# Altium project ArduinoUnoSheild.PrjPcb
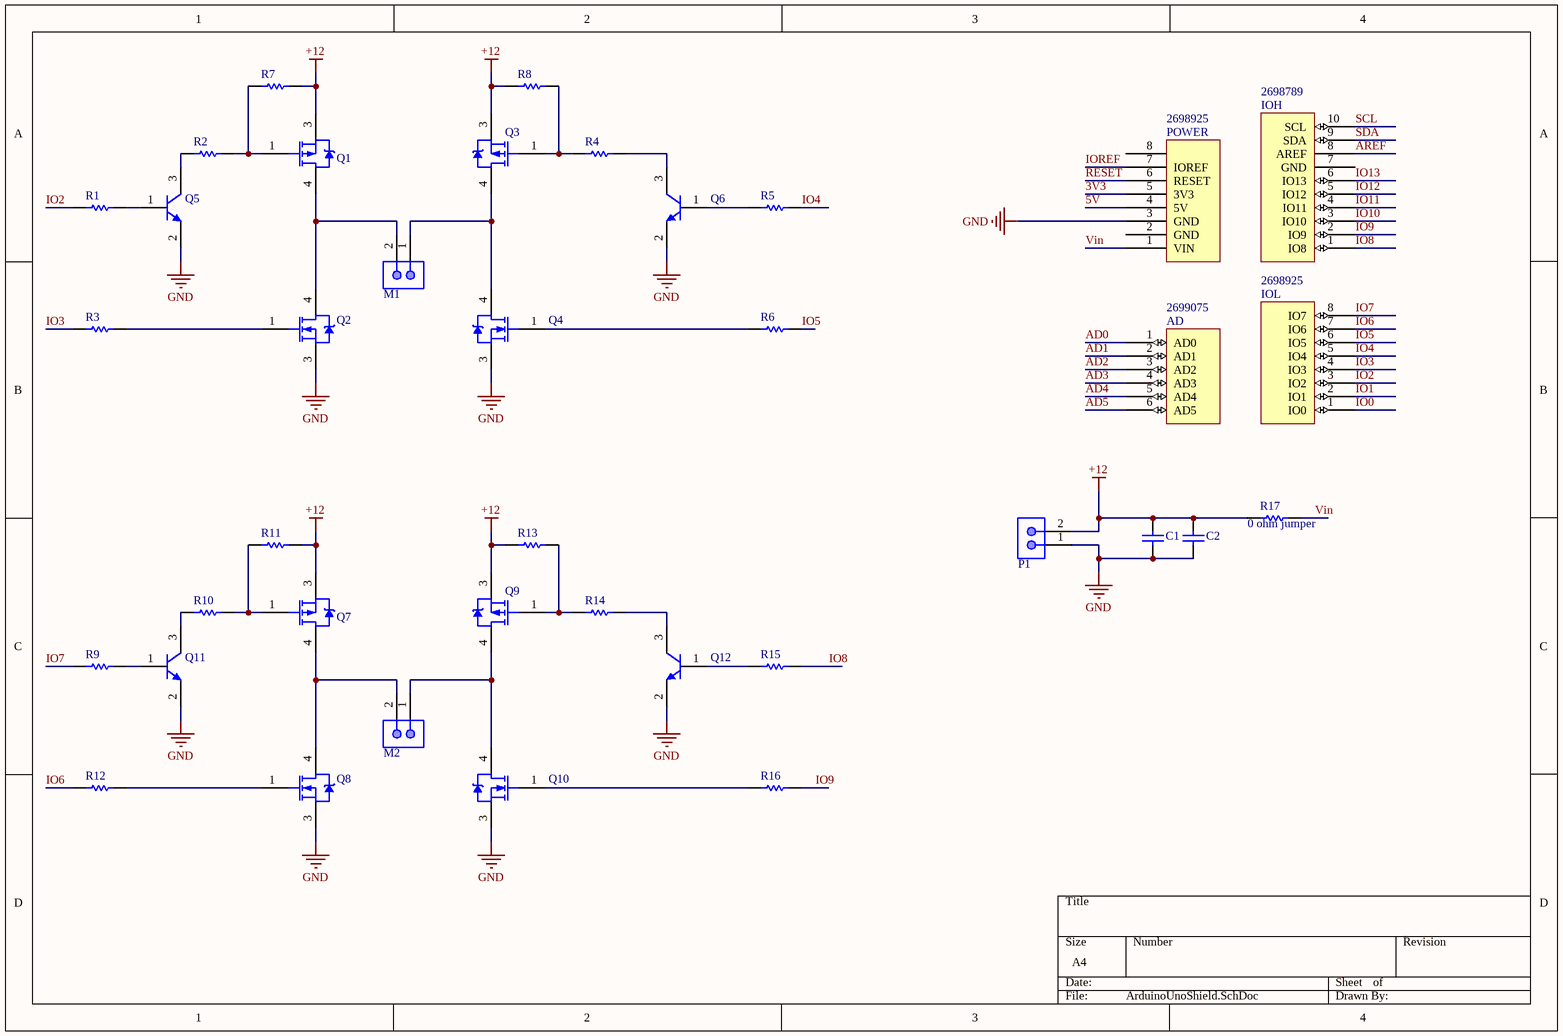
[diagram p0: ArduinoUnoShield.SchDoc]
1 sheet, 38 parts. Net scope: global (net labels, ports and power ports of the same name join across sheets).
Board file: ArduinoUnoShield.PcbDoc

## Sheet ArduinoUnoShield.SchDoc
size A4

### Parts
AD  Supplier Part Number 4: 2699075  [Header 6x1 8.5mm]  (hidden comment: AD)
C1  CAP 100nF 50V 1206(3216)  [CAPC1206(3216)100_L]  (value not drawn)
C2  CAP 100nF 50V 1206(3216)  [CAPC1206(3216)100_L]  (value not drawn)
IOH  Supplier Part Number 3: 2698789  [Header 10x1 8.5mm]  (hidden comment: IOH)
IOL  Supplier Part Number 4: 2698925  [Header 8x1 8.5mm]  (hidden comment: IOL)
M1  68000-102HLF  [AMPH-68000-102HLF_V]  (value not drawn)
M2  68000-102HLF  [AMPH-68000-102HLF_V]  (value not drawn)
P1  68000-102HLF  [AMPH-68000-102HLF_V]  (value not drawn)
POWER  Supplier Part Number 4: 2698925  [Header 8x1 8.5mm]  (hidden comment: POWER_UNO)
Q1  IRF9630STRLPBF‎  [ONSC-D2PAK-3-418B-04_V]  (value not drawn)
Q2  IRF630NSTRLPBF‎  [ONSC-D2PAK-3-418B-04_V]  (value not drawn)
Q3  IRF9630STRLPBF‎  [ONSC-D2PAK-3-418B-04_V]  (value not drawn)
Q4  IRF630NSTRLPBF‎  [ONSC-D2PAK-3-418B-04_V]  (value not drawn)
Q5  BC817-16LT1G  [ONSC-SOT-23-3-318-08_V]  (value not drawn)
Q6  BC817-16LT1G  [ONSC-SOT-23-3-318-08_V]  (value not drawn)
Q7  IRF9630STRLPBF‎  [ONSC-D2PAK-3-418B-04_V]  (value not drawn)
Q8  IRF630NSTRLPBF‎  [ONSC-D2PAK-3-418B-04_V]  (value not drawn)
Q9  IRF9630STRLPBF‎  [ONSC-D2PAK-3-418B-04_V]  (value not drawn)
Q10  IRF630NSTRLPBF‎  [ONSC-D2PAK-3-418B-04_V]  (value not drawn)
Q11  BC817-16LT1G  [ONSC-SOT-23-3-318-08_V]  (value not drawn)
Q12  BC817-16LT1G  [ONSC-SOT-23-3-318-08_V]  (value not drawn)
R1  CRCW1206220KFKEA  [RESC3216X60X45NL10T20]  (value not drawn)
R2  CRCW1206220KFKEA  [RESC3216X60X45NL10T20]  (value not drawn)
R3  CRCW1206220KFKEA  [RESC3216X60X45NL10T20]  (value not drawn)
R4  CRCW1206220KFKEA  [RESC3216X60X45NL10T20]  (value not drawn)
R5  CRCW1206220KFKEA  [RESC3216X60X45NL10T20]  (value not drawn)
R6  CRCW1206220KFKEA  [RESC3216X60X45NL10T20]  (value not drawn)
R7  CRCW1206220KFKEA  [RESC3216X60X45NL10T20]  (value not drawn)
R8  CRCW1206220KFKEA  [RESC3216X60X45NL10T20]  (value not drawn)
R9  CRCW1206220KFKEA  [RESC3216X60X45NL10T20]  (value not drawn)
R10  CRCW1206220KFKEA  [RESC3216X60X45NL10T20]  (value not drawn)
R11  CRCW1206220KFKEA  [RESC3216X60X45NL10T20]  (value not drawn)
R12  CRCW1206220KFKEA  [RESC3216X60X45NL10T20]  (value not drawn)
R13  CRCW1206220KFKEA  [RESC3216X60X45NL10T20]  (value not drawn)
R14  CRCW1206220KFKEA  [RESC3216X60X45NL10T20]  (value not drawn)
R15  CRCW1206220KFKEA  [RESC3216X60X45NL10T20]  (value not drawn)
R16  CRCW1206220KFKEA  [RESC3216X60X45NL10T20]  (value not drawn)
R17  CRCW1206220KFKEA  [RESC3216X60X45NL10T20]  (value not drawn)

### Nets
+12: C1.1 C2.1 P1.2 Q1.3(S) Q3.3(S) Q7.3(S) Q9.3(S) R7.2 R8.1 R11.2 R13.1 R17.1
GND: C1.2 C2.2 P1.1 POWER.3(GND) Q2.3(S) Q4.3(S) Q5.2(E) Q6.2(E) Q8.3(S) Q10.3(S) Q11.2(E) Q12.2(E)
3V3: POWER.5(3V3)
5V: POWER.4(5V)
AD0: AD.1(AD0)
AD1: AD.2(AD1)
AD2: AD.3(AD2)
AD3: AD.4(AD3)
AD4: AD.5(AD4)
AD5: AD.6(AD5)
AREF: IOH.8(AREF)
IO0: IOL.1(IO0)
IO1: IOL.2(IO1)
IO2: IOL.3(IO2) R1.1
IO3: IOL.4(IO3) R3.1
IO4: IOL.5(IO4) R5.2
IO5: IOL.6(IO5) R6.2
IO6: IOL.7(IO6) R12.1
IO7: IOL.8(IO7) R9.1
IO8: IOH.1(IO8) R15.2
IO9: IOH.2(IO9) R16.2
IO10: IOH.3(IO10)
IO11: IOH.4(IO11)
IO12: IOH.5(IO12)
IO13: IOH.6(IO13)
IOREF: POWER.7(IOREF)
RESET: POWER.6(RESET)
SCL: IOH.10(SCL)
SDA: IOH.9(SDA)
Vin: POWER.1(VIN) R17.2
NetM1_1: M1.1 Q3.4(D) Q4.4(D)
NetM1_2: M1.2 Q1.4(D) Q2.4(D)
NetM2_1: M2.1 Q9.4(D) Q10.4(D)
NetM2_2: M2.2 Q7.4(D) Q8.4(D)
NetQ1_1: Q1.1(G) R2.2 R7.1
NetQ2_1: Q2.1(G) R3.2
NetQ3_1: Q3.1(G) R4.1 R8.2
NetQ4_1: Q4.1(G) R6.1
NetQ5_1: Q5.1(B) R1.2
NetQ5_3: Q5.3(C) R2.1
NetQ6_1: Q6.1(B) R5.1
NetQ6_3: Q6.3(C) R4.2
NetQ7_1: Q7.1(G) R10.2 R11.1
NetQ8_1: Q8.1(G) R12.2
NetQ9_1: Q9.1(G) R13.2 R14.1
NetQ10_1: Q10.1(G) R16.1
NetQ11_1: Q11.1(B) R9.2
NetQ11_3: Q11.3(C) R10.1
NetQ12_1: Q12.1(B) R15.1
NetQ12_3: Q12.3(C) R14.2

Not connected (* = marked no-connect by the designer): IOH 7(GND); POWER 2(GND) 8

### Notes on the sheet
- (near R17) 0 ohm jumper

### Library data of the parts
C1 C2 = CMP-1037-04202-1: CAP 100nF 50V ±10% 1206 (3216 Metric) Thickness 1mm SMD; Case-Metric: 3216; Tolerance: Â±10%; Case-EIA: 1206; Technology: SMT; Value: 100nF; Max Thickness: 1 mm; Rated Voltage: 50 V
M1 M2 P1 = CMP-2000-05666-1: Male Header, Pitch 2.54 mm, 1 x 2 Position, Height 8.38 mm, Tail Length 2.41 mm, RoHS, Bulk; Number of Positions: 2; Insulation Resistance: 5000MOhms; Voltage Rating: 1.5kV; Mounting Angle: Vertical; Pitch: 2.54mm; Brand: FCI; Current Rating: 3A; Mating Post Length: 5.84mm; Operating Temperature Range: -65Cto+125C; Product Category: Headers&WireHousings; Datasheet URL: https://datasheet.ciiva.com/5149/68000-274228-5149165.pdf; Number of Positions / Contacts: 2; Contact Gender: Pin(Male); Packaging: Bulk; Mounting Technology: ThroughHole; Product Type: Headers; Housing Material: Thermoplastic; Contact Material: PhosphorBronze; Contact Plating: Gold/GTX; Package Description: Male Header, Pitch 2.54 mm, 1 x 2 Position, Height 8.38 mm, Tail Length 2.41 mm; Package Reference: 68000-102HLF; Type: Unshrouded; Factory Pack Quantity: 100; Termination Style: ThroughHole; RoHS: Details; Series: 68000; Mounting Style: ThroughHole; Flammability Rating: UL94V-0; Number of Rows: 1; Manufacturer: FCI; Termination Post Length: 2.41mm; Manufacturer URL: http://www.amphenol.com/; Datasheet Version: Rev. F, 04/2006
Q1 Q3 Q7 Q9 = CMP-1058-00099-1: Power MOSFET, 50 A, 30 V, Logic Level, P-Channel, 3-Pin D2PAK, Pb-Free, Tape and Reel; PartNumber: MTB50P03HDLT4G; Manufacturer: On Semiconductor; Configuration: Single; Crss Typ (pF): 550; VGS Max (V): 15; VGS(th) Max (V): 2; Qrr Typ (nC): 246; V(BR)DSS Min (V): 30; Coss Typ (pF): 1550; Channel Polarity: P Channel; Ciss Typ (pF): 3500; ComponentLink2Description: Datasheet; ComponentLink1URL: http://www.onsemi.com/; ComponentLink3URL: http://www.onsemi.com/pub_link/Collateral/418B-04.PDF; ComponentLink3Description: Package Specification; PackageVersion: Rev. K, 09/2008; DatasheetVersion: Rev. 6; PackageDescription: 3-Pin Flange Mount, Body 9.145 x 9.97 mm, Pitch 2.54 mm; RoHS: Pb-Free; Packing: Tape and Reel; Mounting Technology: Surface Mount; ComponentLink2URL: http://www.onsemi.cn/pub_link/Collateral/MTB50P03HDL-D.PDF; PackageReference: D2PAK-3-418B-04; ComponentLink1Description: Manufacturer URL; Package Type: D2PAK-3
Q2 Q4 Q8 Q10 = CMP-1058-00123-1: Power MOSFET, 60 V, 60 A, N-Channel, 3-Pin D2PAK, Pb-Free, Tape and Reel; Manufacturer: On Semiconductor; PartNumber: NTB60N06T4G; Crss Typ (pF): 144; VGS(th) Max (V): 4; Configuration: Single; Channel Polarity: N Channel; V(BR)DSS Min (V): 60; Qrr Typ (nC): 146; Coss Typ (pF): 660; Ciss Typ (pF): 2300; PackageReference: D2PAK-3-418B-04; ComponentLink2URL: http://www.onsemi.cn/pub_link/Collateral/NTB60N06-D.PDF; Packing: Tape and Reel; DatasheetVersion: Rev. 0; ComponentLink3Description: Package Specification; ComponentLink1Description: Manufacturer URL; ComponentLink3URL: http://www.onsemi.com/pub_link/Collateral/418B-04.PDF; PackageDescription: 3-Pin Flange Mount, Body 9.145 x 9.97 mm, Pitch 2.54 mm; Mounting Technology: Surface Mount; RoHS: Pb-Free; Package Type: D2PAK-3; ComponentLink2Description: Datasheet; ComponentLink1URL: http://www.onsemi.com/; PackageVersion: Rev. K, 09/2008
Q5 Q6 Q11 Q12 = CMP-1048-00736-1: General Purpose Transistor, NPN Silicon, 3-Pin SOT-23, Pb-Free, Tape and Reel; Manufacturer: On Semiconductor; IC Continuous (A): 0.5; fT Min (MHz): 100; PartNumber: BC817-16LT1G; Mounting Technology: Surface Mount; PackageVersion: Rev. AP, 11/2009; ComponentLink3Description: Package Specification; PackageReference: SOT-23-3-318-08; Packing: Tape and Reel; ComponentLink1URL: http://www.onsemi.com/; Polarity: NPN; RoHS: TRUE; ComponentLink2URL: http://www.onsemi.com/pub_link/Collateral/BC817-16LT1-D.PDF; ComponentLink3URL: http://www.onsemi.cn/pub_link/Collateral/318-08.PDF; ComponentLink2Description: Datasheet; PackageDescription: 3-Pin Small Outline Transistor, Body 2.92 x 1.3 mm, Pitch 0.95 mm; ComponentLink1Description: Manufacturer URL; DatasheetVersion: Rev. 12
R1-R17 = CMP-2003-01954-1: Manufacturer: Vishay Dale; Part Number: CRCW1206220KFKEA
AD = AD: Supplier 1: Arrow; Supplier Part Number 1: 2699089; Supplier 2: Digi-Key; Supplier Part Number 2: SAM1198-06-ND; Supplier 3: Arrow; Supplier Part Number 3: 2699088; Supplier 4: Arrow
IOH = IOH: Supplier 1: Arrow; Supplier Part Number 1: 2698803S4475693N1004; Supplier 2: Digi-Key; Supplier Part Number 2: SAM1198-10-ND; Supplier 3: Arrow
IOL = IOL: Supplier 1: Digi-Key; Supplier Part Number 1: SAM1198-08-ND; Supplier 2: Arrow; Supplier Part Number 2: 2698939; Supplier 3: Arrow; Supplier Part Number 3: 2698940; Supplier 4: Arrow
POWER = POWER_UNO: Supplier 1: Digi-Key; Supplier Part Number 1: SAM1198-08-ND; Supplier 2: Arrow; Supplier Part Number 2: 2698939; Supplier 3: Arrow; Supplier Part Number 3: 2698940; Supplier 4: Arrow